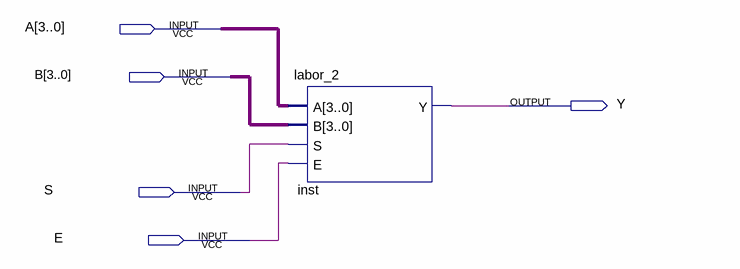
[diagram p0: schematic sheet]
// Quartus schematic Block_diagramm.bdf as structural Verilog: 1 symbols, 5 pins
module Block_diagramm (
  input  [3:0] A,
  input  [3:0] B,
  input  S,
  input  E,
  output Y
);

  labor_2 inst (.A(A), .B(B), .S(S), .E(E), .Y(Y));
endmodule
